# Altium schematic sheet MIC24085.SchDoc
size A
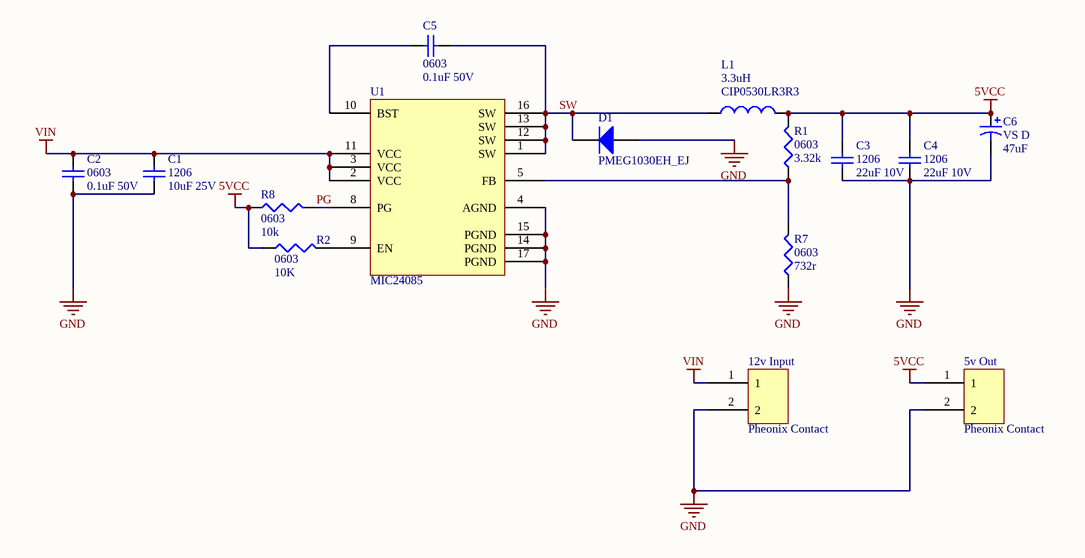
[diagram p0: MIC24085.SchDoc]

## Parts
5v_Out  Pheonix Contact  [CON-PHEONIX-508-Alt]
12v_Input  Pheonix Contact  [CON-PHEONIX-508-Alt]
C1  1206  value 10uF 25V  [C1206]
C2  0603  value 0.1uF 50V  [1608[0603]]
C3  1206  value 22uF 10V  [C1206]
C4  1206  value 22uF 10V  [C1206]
C5  0603  value 0.1uF 50V  [1608[0603]]
C6  VS D  value 47uF  [Panasonic VS D]
D1  PMEG1030EH_EJ  [SK33A - SOD123]
L1  CIP0530LR3R3  value 3.3uH  [CIP0530LR3R3]
R1  0603  value 3.32k  [J1-0603]
R2  0603  value 10K  [J1-0603]
R7  0603  value 732r  [J1-0603]
R8  0603  value 10k  [J1-0603]
U1  MIC24085  [MIC24085-AYML]

## Nets
5VCC: 5v_Out.1 C3.2 C4.2 C6.1 L1.2 R1.2 R2.1 R8.1
GND: 5v_Out.2 12v_Input.2 C1.1 C2.1 C3.1 C4.1 C6.2 D1.1(A) R7.1 U1.4(AGND) U1.14(PGND) U1.15(PGND) U1.17(PGND)
VIN: 12v_Input.1 C1.2 C2.2 U1.2(VCC) U1.3(VCC) U1.11(VCC)
PG: R8.2 U1.8(PG)
SW: C5.2 D1.2(K) L1.1 U1.1(SW) U1.12(SW) U1.13(SW) U1.16(SW)
NetC5_1: C5.1 U1.10(BST)
NetR1_1: R1.1 R7.2 U1.5(FB)
NetR2_2: R2.2 U1.9(EN)

Not connected (* = marked no-connect by the designer): U1 6(NC) 7(NC)

## Library data of the parts
5v_Out 12v_Input = Pheonix Contact 2X1
C1-C5 = Cap Semi: Capacitor (Semiconductor SIM Model); Published: 8-Jun-2000; LatestRevisionDate: 29-May-2009; LatestRevisionNote: IPC-7351 Footprint Added.; PackageReference: C1206; Publisher: Altium Limited; PackageDescription: Chip Capacitor
C6 = Cap Pol1: Polarized Capacitor (Radial); Published: 8-Jun-2000; LatestRevisionDate: 17-Jul-2002; LatestRevisionNote: Re-released for DXP Platform.; PackageReference: RB7.6-15; Publisher: Altium Limited; PackageDescription: Polarized Capacitor (Radial); 2 Leads
D1 = PMEG1030EH_EJ: Default Diode; Published: 8-Jun-2000; LatestRevisionDate: 17-Jul-2002; LatestRevisionNote: Re-released for DXP Platform.; PackageVersion: Sep-1996; PackageReference: SMC; Publisher: Altium Limited; PackageDescription: DO-214-AB/SMC; 2 C-Bend Leads; Body 7.9 x 5.9 mm, inc. leads (LxW); Code_JEDEC: DO-214-AB
L1 = Inductor: Code_IEC: 1005; Published: 8-Jun-2000; LatestRevisionDate: 29-May-2009; LatestRevisionNote: IPC-7351 Footprint Added.; PackageReference: 0402-A; Publisher: Altium Limited; PackageDescription: Chip Inductor; Code_JEITA: 0402
R1 R2 R7 R8 = Res3: Resistor; Published: 8-Jun-2000; LatestRevisionDate: 29-May-2009; LatestRevisionNote: IPC-7351 Footprint Added.; PackageReference: J1-0603; Publisher: Altium Limited; PackageDescription: Chip Resistor